# Altium schematic sheet BLOCK7.SchDoc
size A3; SheetNumber: 7; SheetTotal: 12
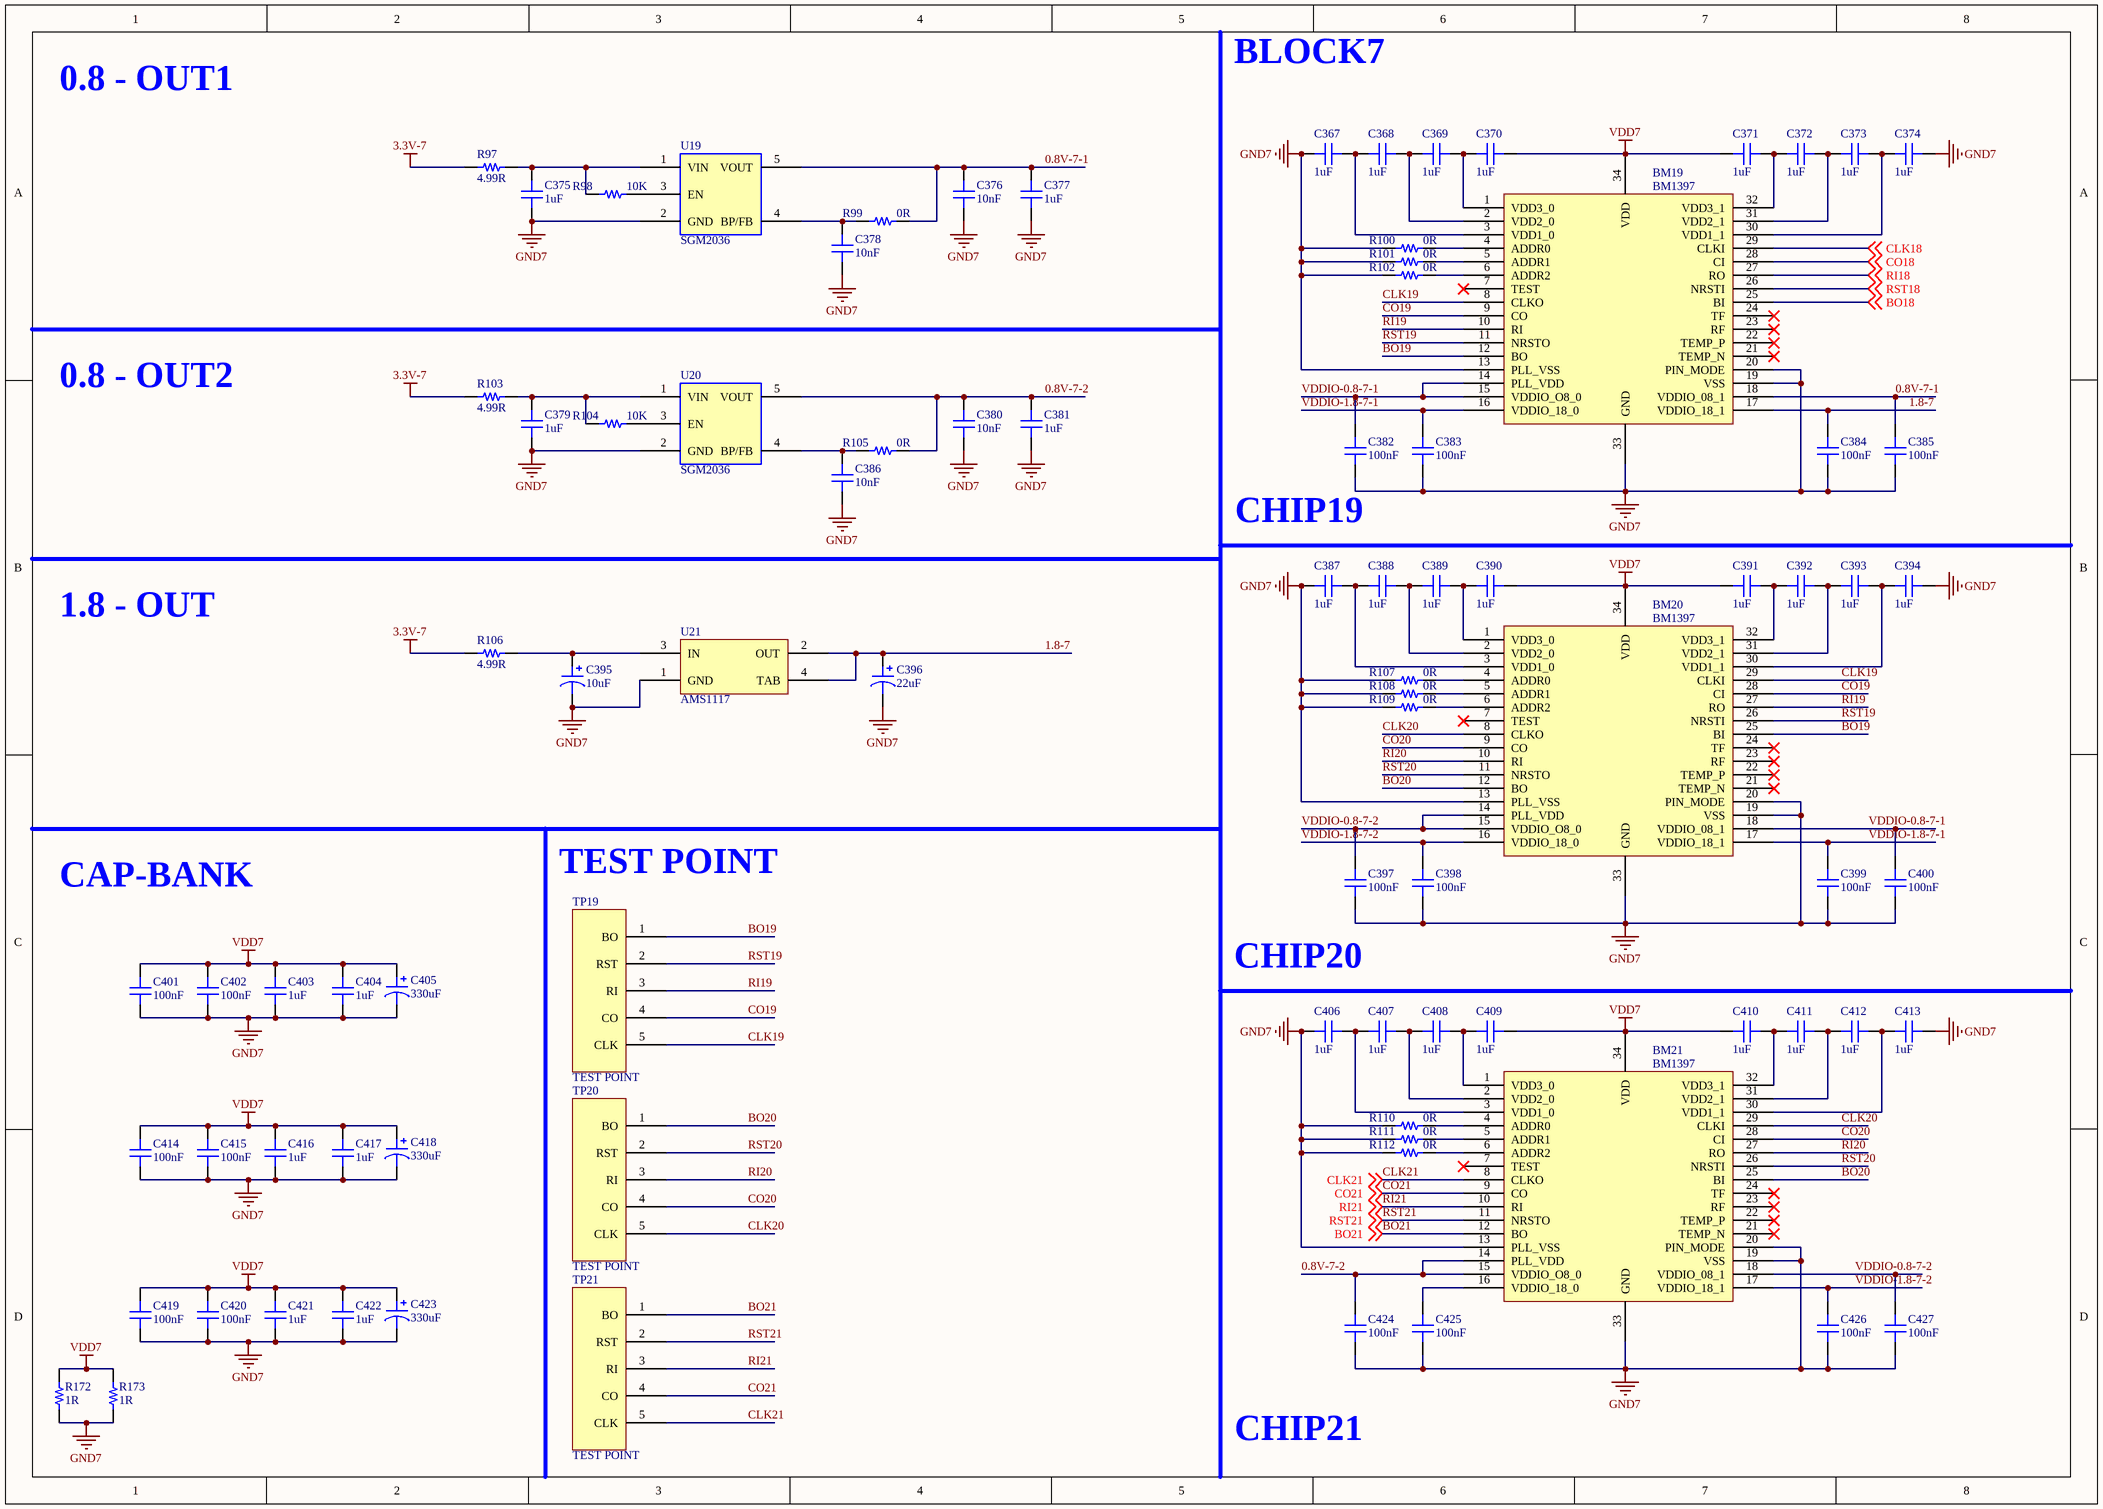
[diagram p0: BLOCK7.SchDoc]

## Parts
BM19  BM1397  [BM1387]
BM20  BM1397  [BM1387]
BM21  BM1397  [BM1387]
C367  1uF  [CAP-SMD-0603]
C368  1uF  [CAP-SMD-0603]
C369  1uF  [CAP-SMD-0603]
C370  1uF  [CAP-SMD-0603]
C371  1uF  [CAP-SMD-0603]
C372  1uF  [CAP-SMD-0603]
C373  1uF  [CAP-SMD-0603]
C374  1uF  [CAP-SMD-0603]
C375  1uF  [CAP_SMD_0805]
C376  10nF  [CAP_SMD_0805]
C377  1uF  [CAP_SMD_0805]
C378  10nF  [CAP_SMD_0805]
C379  1uF  [CAP_SMD_0805]
C380  10nF  [CAP_SMD_0805]
C381  1uF  [CAP_SMD_0805]
C382  100nF  [CAP_SMD_0805]
C383  100nF  [CAP_SMD_0805]
C384  100nF  [CAP_SMD_0805]
C385  100nF  [CAP_SMD_0805]
C386  10nF  [CAP_SMD_0805]
C387  1uF  [CAP-SMD-0603]
C388  1uF  [CAP-SMD-0603]
C389  1uF  [CAP-SMD-0603]
C390  1uF  [CAP-SMD-0603]
C391  1uF  [CAP-SMD-0603]
C392  1uF  [CAP-SMD-0603]
C393  1uF  [CAP-SMD-0603]
C394  1uF  [CAP-SMD-0603]
C395  10uF  [CAP-TAN-CASE-A]
C396  22uF  [CAP-TAN-CASE-A]
C397  100nF  [CAP_SMD_0805]
C398  100nF  [CAP_SMD_0805]
C399  100nF  [CAP_SMD_0805]
C400  100nF  [CAP_SMD_0805]
C401  100nF  [CAP_SMD_0805]
C402  100nF  [CAP_SMD_0805]
C403  1uF  [CAP_SMD_0805]
C404  1uF  [CAP_SMD_0805]
C405  330uF  [CAP-TAN-CASE-E]
C406  1uF  [CAP-SMD-0603]
C407  1uF  [CAP-SMD-0603]
C408  1uF  [CAP-SMD-0603]
C409  1uF  [CAP-SMD-0603]
C410  1uF  [CAP-SMD-0603]
C411  1uF  [CAP-SMD-0603]
C412  1uF  [CAP-SMD-0603]
C413  1uF  [CAP-SMD-0603]
C414  100nF  [CAP_SMD_0805]
C415  100nF  [CAP_SMD_0805]
C416  1uF  [CAP_SMD_0805]
C417  1uF  [CAP_SMD_0805]
C418  330uF  [CAP-TAN-CASE-E]
C419  100nF  [CAP_SMD_0805]
C420  100nF  [CAP_SMD_0805]
C421  1uF  [CAP_SMD_0805]
C422  1uF  [CAP_SMD_0805]
C423  330uF  [CAP-TAN-CASE-E]
C424  100nF  [CAP_SMD_0805]
C425  100nF  [CAP_SMD_0805]
C426  100nF  [CAP_SMD_0805]
C427  100nF  [CAP_SMD_0805]
R97  4.99R  [RES-SMD-1206]
R98  10K  [RES-SMD-0402]
R99  0R  [RES-SMD-0402]
R100  0R  [RES-SMD-0402]
R101  0R  [RES-SMD-0402]
R102  0R  [RES-SMD-0402]
R103  4.99R  [RES-SMD-1206]
R104  10K  [RES-SMD-0402]
R105  0R  [RES-SMD-0402]
R106  4.99R  [RES-SMD-1206]
R107  0R  [RES-SMD-0402]
R108  0R  [RES-SMD-0402]
R109  0R  [RES-SMD-0402]
R110  0R  [RES-SMD-0402]
R111  0R  [RES-SMD-0402]
R112  0R  [RES-SMD-0402]
R172  1R  [RES-SMD-1210]
R173  1R  [RES-SMD-1210]
TP19  TEST POINT  [TEST_POINT]
TP20  TEST POINT  [TEST_POINT]
TP21  TEST POINT  [TEST_POINT]
U19  SGM2036  [SOT23-5PIN]
U20  SGM2036  [SOT23-5PIN]
U21  AMS1117  [AMS1117]

## Nets
3.3V-7: R97.1 R103.1 R106.1
GND7: BM19.13(PLL_VSS) BM19.19(VSS) BM19.20(PIN_MODE) BM19.33(GND) BM20.13(PLL_VSS) BM20.19(VSS) BM20.20(PIN_MODE) BM20.33(GND) BM21.13(PLL_VSS) BM21.19(VSS) BM21.20(PIN_MODE) BM21.33(GND) C367.1 C374.2 C375.1 C376.1 C377.1 C378.1 C379.1 C380.1 C381.1 C382.1 C383.1 C384.1 C385.1 C386.1 C387.1 C394.2 C395.2 C396.2 C397.1 C398.1 C399.1 C400.1 C401.1 C402.1 C403.1 C404.1 C405.2 C406.1 C413.2 C414.1 C415.1 C416.1 C417.1 C418.2 C419.1 C420.1 C421.1 C422.1 C423.2 C424.1 C425.1 C426.1 C427.1 R100.1 R101.1 R102.1 R107.1 R108.1 R109.1 R110.1 R111.1 R112.1 R172.1 R173.1 U19.2(GND) U20.2(GND) U21.1(GND)
VDD7: BM19.34(VDD) BM20.34(VDD) BM21.34(VDD) C370.2 C371.1 C390.2 C391.1 C401.2 C402.2 C403.2 C404.2 C405.1 C409.2 C410.1 C414.2 C415.2 C416.2 C417.2 C418.1 C419.2 C420.2 C421.2 C422.2 C423.1 R172.2 R173.2
0.8V-7-1: BM19.18(VDDIO_08_1) C376.2 C377.2 C385.2 R99.2 U19.5(VOUT)
0.8V-7-2: BM21.14(PLL_VDD) BM21.15(VDDIO_O8_0) C380.2 C381.2 C424.2 R105.2 U20.5(VOUT)
1.8-7: BM19.17(VDDIO_18_1) C384.2 C396.1 U21.2(OUT) U21.4(TAB)
BO18: BM19.25(BI) ; off-sheet BO18
BO19: BM19.12(BO) BM20.25(BI) TP19.1(BO)
BO20: BM20.12(BO) BM21.25(BI) TP20.1(BO)
BO21: BM21.12(BO) TP21.1(BO) ; off-sheet BO21
CLK18: BM19.29(CLKI) ; off-sheet CLK18
CLK19: BM19.8(CLKO) BM20.29(CLKI) TP19.5(CLK)
CLK20: BM20.8(CLKO) BM21.29(CLKI) TP20.5(CLK)
CLK21: BM21.8(CLKO) TP21.5(CLK) ; off-sheet CLK21
CO18: BM19.28(CI) ; off-sheet CO18
CO19: BM19.9(CO) BM20.28(CI) TP19.4(CO)
CO20: BM20.9(CO) BM21.28(CI) TP20.4(CO)
CO21: BM21.9(CO) TP21.4(CO) ; off-sheet CO21
RI18: BM19.27(RO) ; off-sheet RI18
RI19: BM19.10(RI) BM20.27(RO) TP19.3(RI)
RI20: BM20.10(RI) BM21.27(RO) TP20.3(RI)
RI21: BM21.10(RI) TP21.3(RI) ; off-sheet RI21
RST18: BM19.26(NRSTI) ; off-sheet RST18
RST19: BM19.11(NRSTO) BM20.26(NRSTI) TP19.2(RST)
RST20: BM20.11(NRSTO) BM21.26(NRSTI) TP20.2(RST)
RST21: BM21.11(NRSTO) TP21.2(RST) ; off-sheet RST21
VDDIO-0.8-7-1: BM19.14(PLL_VDD) BM19.15(VDDIO_O8_0) BM20.18(VDDIO_08_1) C382.2 C400.2
VDDIO-0.8-7-2: BM20.14(PLL_VDD) BM20.15(VDDIO_O8_0) BM21.18(VDDIO_08_1) C397.2 C427.2
VDDIO-1.8-7-1: BM19.16(VDDIO_18_0) BM20.17(VDDIO_18_1) C383.2 C399.2
VDDIO-1.8-7-2: BM20.16(VDDIO_18_0) BM21.17(VDDIO_18_1) C398.2 C426.2
NetBM19_1: BM19.1(VDD3_0) C369.2 C370.1
NetBM19_2: BM19.2(VDD2_0) C368.2 C369.1
NetBM19_3: BM19.3(VDD1_0) C367.2 C368.1
NetBM19_4: BM19.4(ADDR0) R100.2
NetBM19_5: BM19.5(ADDR1) R101.2
NetBM19_6: BM19.6(ADDR2) R102.2
NetBM19_30: BM19.30(VDD1_1) C373.2 C374.1
NetBM19_31: BM19.31(VDD2_1) C372.2 C373.1
NetBM19_32: BM19.32(VDD3_1) C371.2 C372.1
NetBM20_1: BM20.1(VDD3_0) C389.2 C390.1
NetBM20_2: BM20.2(VDD2_0) C388.2 C389.1
NetBM20_3: BM20.3(VDD1_0) C387.2 C388.1
NetBM20_4: BM20.4(ADDR0) R107.2
NetBM20_5: BM20.5(ADDR1) R108.2
NetBM20_6: BM20.6(ADDR2) R109.2
NetBM20_30: BM20.30(VDD1_1) C393.2 C394.1
NetBM20_31: BM20.31(VDD2_1) C392.2 C393.1
NetBM20_32: BM20.32(VDD3_1) C391.2 C392.1
NetBM21_1: BM21.1(VDD3_0) C408.2 C409.1
NetBM21_2: BM21.2(VDD2_0) C407.2 C408.1
NetBM21_3: BM21.3(VDD1_0) C406.2 C407.1
NetBM21_4: BM21.4(ADDR0) R110.2
NetBM21_5: BM21.5(ADDR1) R111.2
NetBM21_6: BM21.6(ADDR2) R112.2
NetBM21_16: BM21.16(VDDIO_18_0) C425.2
NetBM21_30: BM21.30(VDD1_1) C412.2 C413.1
NetBM21_31: BM21.31(VDD2_1) C411.2 C412.1
NetBM21_32: BM21.32(VDD3_1) C410.2 C411.1
NetC375_2: C375.2 R97.2 R98.1 U19.1(VIN)
NetC378_2: C378.2 R99.1 U19.4(BP/FB)
NetC379_2: C379.2 R103.2 R104.1 U20.1(VIN)
NetC386_2: C386.2 R105.1 U20.4(BP/FB)
NetC395_1: C395.1 R106.2 U21.3(IN)
NetR98_2: R98.2 U19.3(EN)
NetR104_2: R104.2 U20.3(EN)

Not connected (* = marked no-connect by the designer): BM19 7(TEST)* 21(TEMP_N)* 22(TEMP_P)* 23(RF)* 24(TF)*; BM20 7(TEST)* 21(TEMP_N)* 22(TEMP_P)* 23(RF)* 24(TF)*; BM21 7(TEST)* 21(TEMP_N)* 22(TEMP_P)* 23(RF)* 24(TF)*

## Notes on the sheet
- 0.8 - OUT1
- BLOCK7
- 0.8 - OUT2
- (near C382) CHIP19
- 1.8 - OUT
- CAP-BANK
- TEST POINT
- CHIP20
- CHIP21

## Library data of the parts
BM19-BM21 = BM1397_0
C367-C394 C397-C404 C406-C417 C419-C422 C424-C427 = CAP
C395 C396 C405 C418 C423 = POLARIZED CAP
R97-R112 R172 R173 = RES